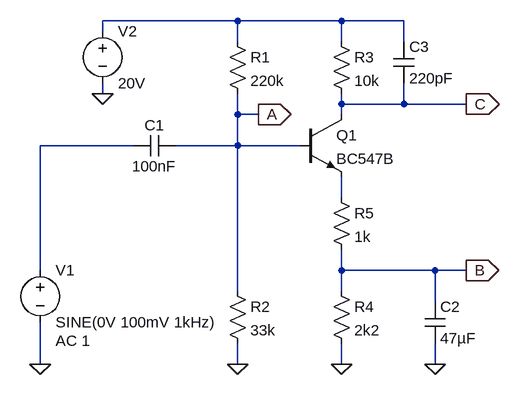
[diagram p0: schematic Draft5_neu.asc]
Draft5_neu.asc, the LTspice schematic file:
Version 4
SHEET 1 880 680
WIRE 384 -256 176 -256
WIRE 544 -256 384 -256
WIRE 640 -256 544 -256
WIRE 176 -240 176 -256
WIRE 384 -224 384 -256
WIRE 544 -224 544 -256
WIRE 640 -224 640 -256
WIRE 176 -144 176 -160
WIRE 544 -128 544 -144
WIRE 640 -128 640 -160
WIRE 640 -128 544 -128
WIRE 736 -128 640 -128
WIRE 384 -112 384 -144
WIRE 416 -112 384 -112
WIRE 544 -112 544 -128
WIRE 224 -64 80 -64
WIRE 384 -64 384 -112
WIRE 384 -64 288 -64
WIRE 480 -64 384 -64
WIRE 544 16 544 -16
WIRE 80 128 80 -64
WIRE 544 128 544 96
WIRE 688 128 544 128
WIRE 736 128 688 128
WIRE 384 160 384 -64
WIRE 544 160 544 128
WIRE 688 176 688 128
WIRE 80 272 80 208
WIRE 384 272 384 240
WIRE 544 272 544 240
WIRE 688 272 688 240
FLAG 80 272 0
FLAG 384 272 0
FLAG 544 272 0
FLAG 688 272 0
FLAG 416 -112 A
IOPIN 416 -112 Out
FLAG 736 128 B
IOPIN 736 128 Out
FLAG 736 -128 C
IOPIN 736 -128 Out
FLAG 176 -144 0
SYMBOL voltage 80 112 R0
WINDOW 123 24 124 Left 2
WINDOW 39 0 0 Left 0
SYMATTR InstName V1
SYMATTR Value SINE(0V 100mV 1kHz)
SYMATTR Value2 AC 1
SYMBOL res 368 144 R0
SYMATTR InstName R2
SYMATTR Value 33k
SYMBOL res 528 144 R0
SYMATTR InstName R4
SYMATTR Value 2k2
SYMBOL cap 672 176 R0
SYMATTR InstName C2
SYMATTR Value 47µF
SYMBOL res 528 0 R0
SYMATTR InstName R5
SYMATTR Value 1k
SYMBOL npn 480 -112 R0
SYMATTR InstName Q1
SYMATTR Value BC547B
SYMBOL cap 288 -80 R90
WINDOW 0 0 32 VBottom 2
WINDOW 3 32 32 VTop 2
SYMATTR InstName C1
SYMATTR Value 100nF
SYMBOL res 368 -240 R0
SYMATTR InstName R1
SYMATTR Value 220k
SYMBOL res 528 -240 R0
SYMATTR InstName R3
SYMATTR Value 10k
SYMBOL cap 624 -224 R0
SYMATTR InstName C3
SYMATTR Value 220pF
SYMBOL voltage 176 -256 R0
WINDOW 123 0 0 Left 0
WINDOW 39 0 0 Left 0
SYMATTR InstName V2
SYMATTR Value 20V

The netlist it stands for:
* Draft5_neu.asc
V1 N002 0 SINE(0V 100mV 1kHz) AC 1
R2 A 0 33k
R4 B 0 2k2
C2 B 0 47µF
R5 N003 B 1k
Q1 C A N003 0 BC547B
C1 A N002 100nF
R1 N001 A 220k
R3 N001 C 10k
C3 N001 C 220pF
V2 N001 0 20V
.model NPN NPN
.model PNP PNP
.lib standard.bjt
.backanno
.end